# EasyEDA Pro project Sound Recorder IoT updated.epro

# Schematic Schematic1
Board Name: Board1; Create Date: 2025-07-08; Page Name: P1; Project Name: Sound Recorder IoT; Schematic Name: Schematic1; Update Date: 2025-07-19; Company: Rajj Engineering; Drawn: UsmanRajj; Page Size: A4; Part Number: JLCPCB-002; Reviewed: @rajjengg; Version: V0.1
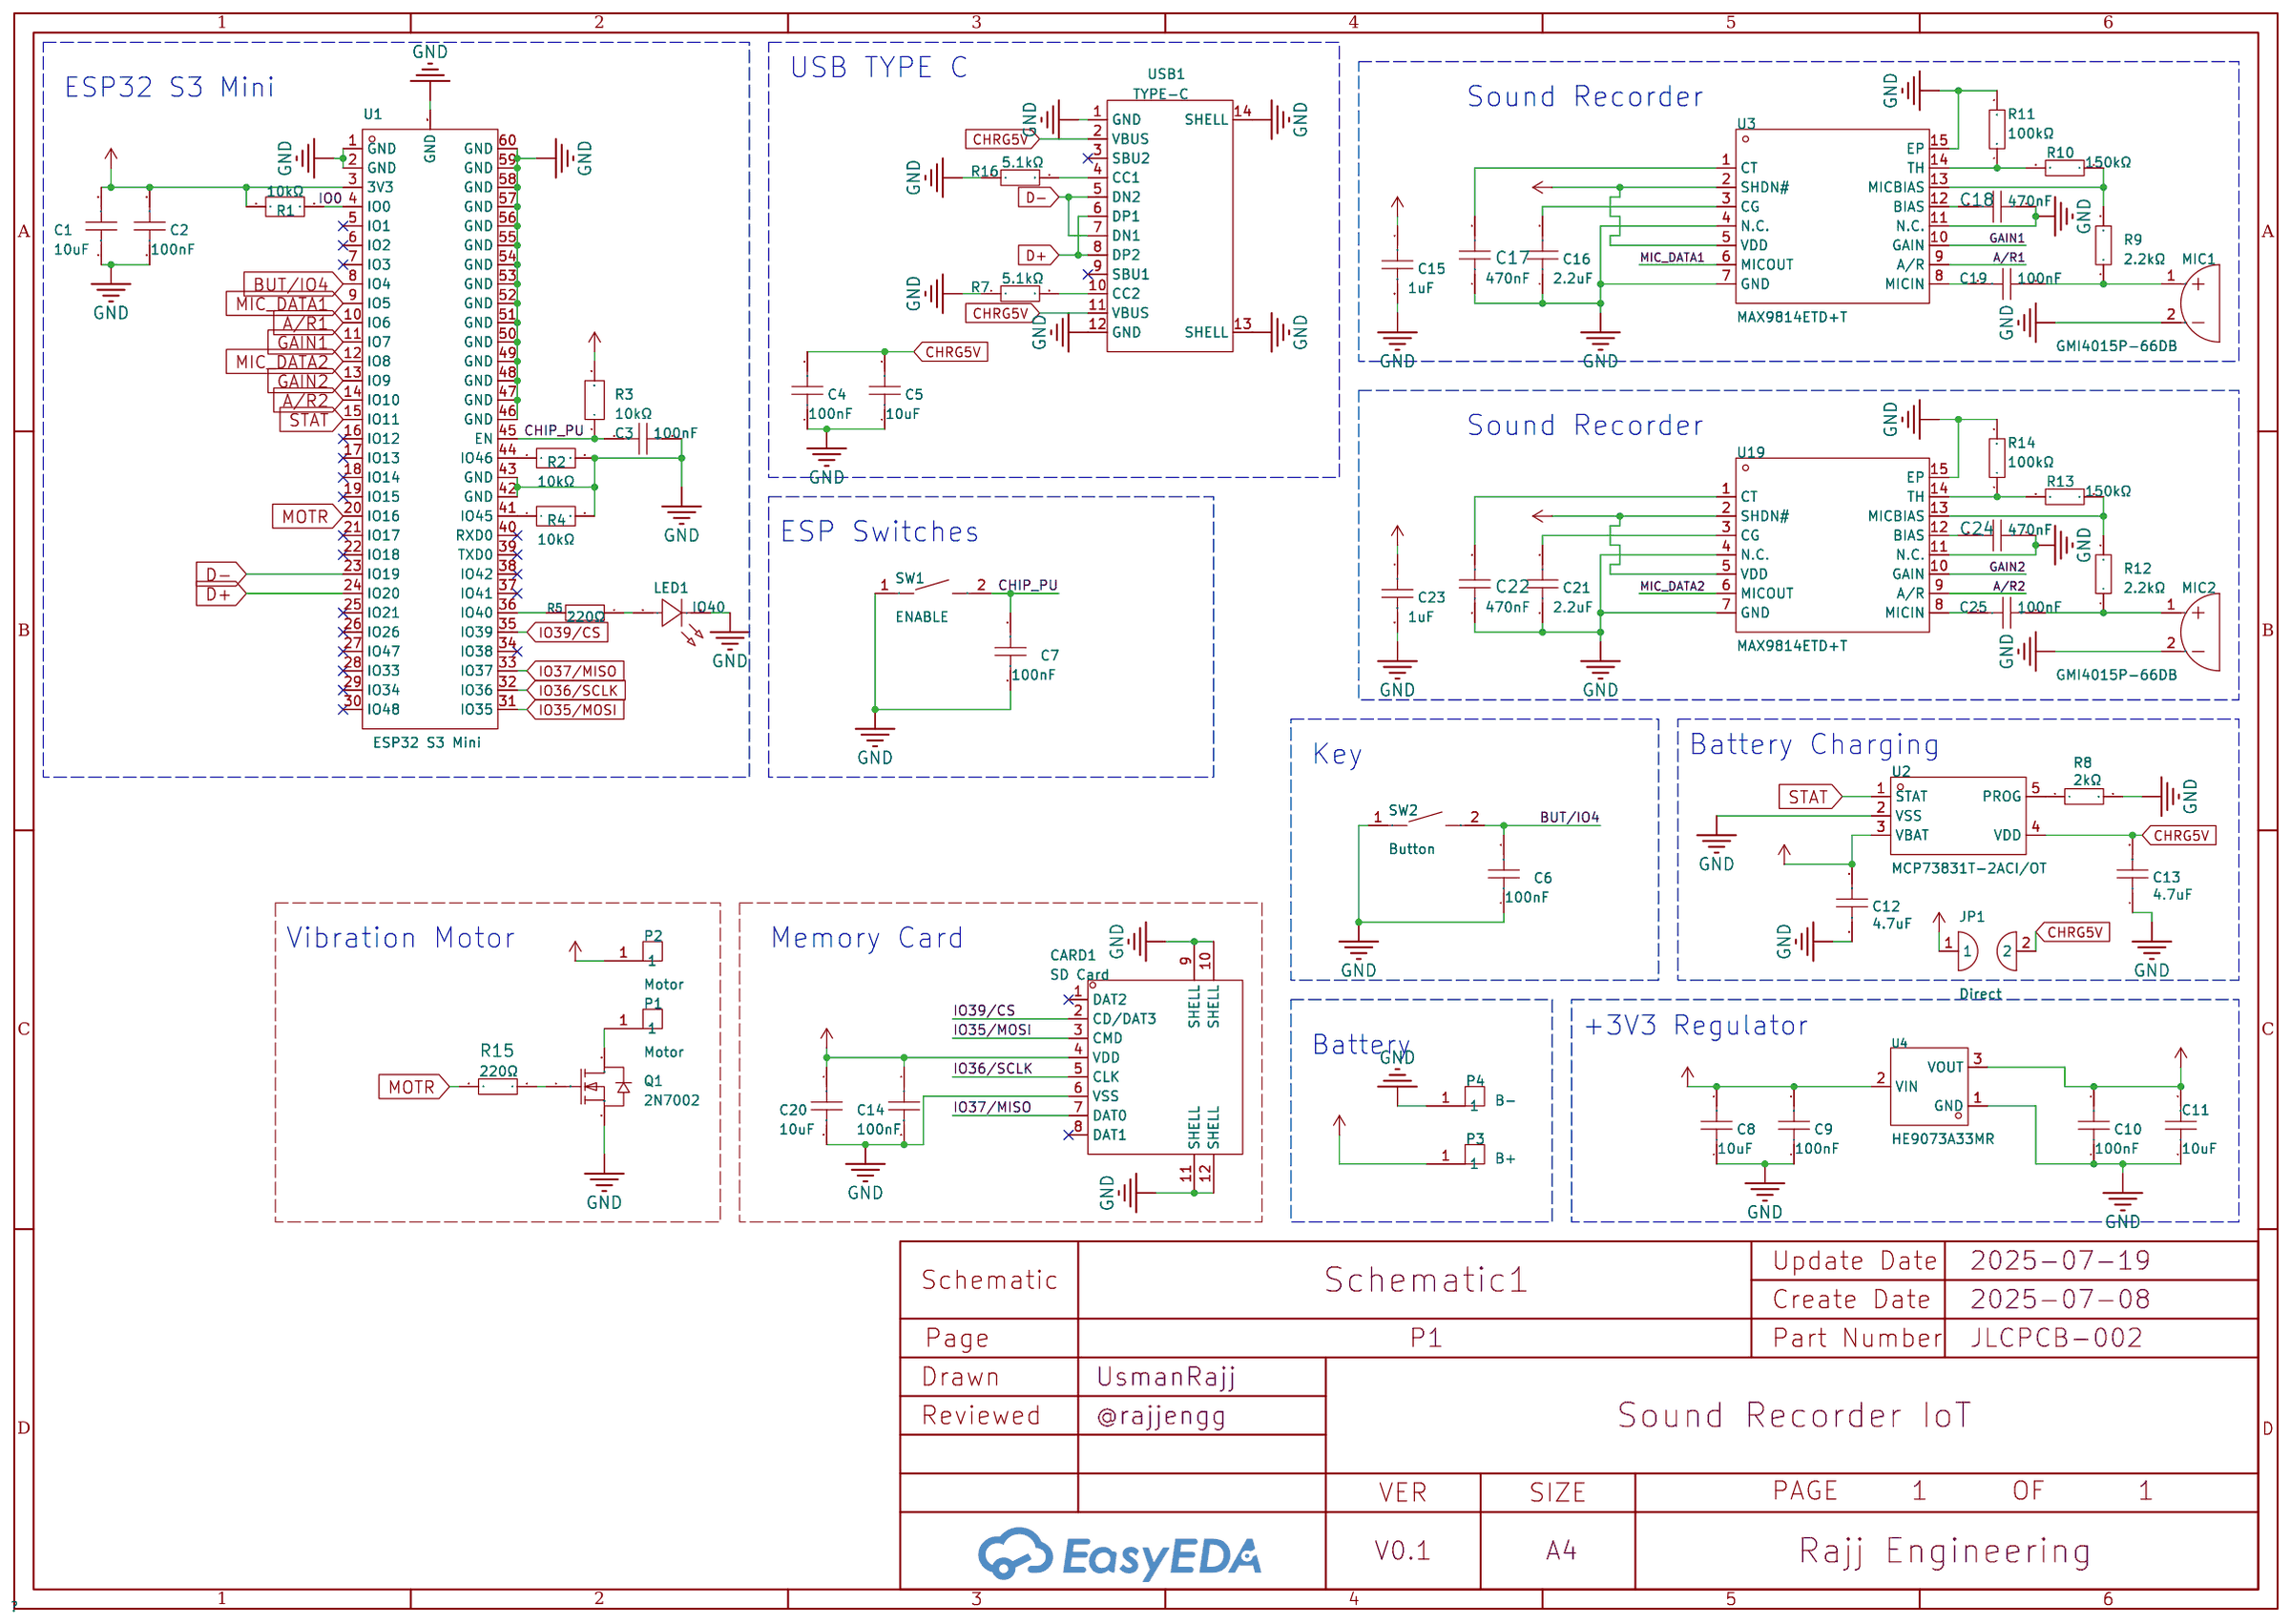
[diagram p0: schematic sheet]

## Parts
C1  10uF  [C0402]
C2  100nF  [C0201]
C3  100nF  [C0201]
C4  100nF  [C0201]
C5  10uF  [C0402]
C6  100nF  [C0201]
C7  100nF  [C0201]
C8  10uF  [C0402]
C9  100nF  [C0201]
C10  100nF  [C0201]
C11  10uF  [C0402]
C12  4.7uF  [C0402]
C13  4.7uF  [C0402]
C14  100nF  [C0201]
C15  1uF  [C0201]
C16  2.2uF  [C0201]
C17  470nF  [C0201]
C18  470nF  [C0201]
C19  100nF  [C0201]
C20  10uF  [C0402]
C21  2.2uF  [C0201]
C22  470nF  [C0201]
C23  1uF  [C0201]
C24  470nF  [C0201]
C25  100nF  [C0201]
CARD1  SD Card  [TF-SMD_TF-102-15]
JP1  Direct  [jumper pad]  (no BOM)
LED1  IO40  [LED0603-RD_BLUE]
MIC1  GMI4015P-66DB  [MIC-TH_BD4.0-P1.4-D0.4-L-FD]
MIC2  GMI4015P-66DB  [MIC-TH_BD4.0-P1.4-D0.4-L-FD]
P1  Motor  [SMD 1.5X2 PAD]  (no BOM)
P2  Motor  [SMD 1.5X2 PAD]  (no BOM)
P3  B+  [SMD 1.5X2 PAD]  (no BOM)
P4  B-  [SMD 1.5X2 PAD]  (no BOM)
Q1  2N7002  [SOT-23-3_L2.9-W1.3-P1.90-LS2.4-BR]
R1  10kΩ  [R0201]
R2  10kΩ  [R0201]
R3  10kΩ  [R0201]
R4  10kΩ  [R0201]
R5  220Ω  [R0402]
R7  5.1kΩ  [R0402]
R8  2kΩ  [R0402]
R9  2.2kΩ  [R0201]
R10  150kΩ  [R0201]
R11  100kΩ  [R0201]
R12  2.2kΩ  [R0201]
R13  150kΩ  [R0201]
R14  100kΩ  [R0201]
R15  220Ω  [R0402]
R16  5.1kΩ  [R0402]
SW1  ENABLE  [SW-SMD_L3.9-W3.0-P4.45]
SW2  Button  [SW-SMD_L3.9-W3.0-P4.45]
U1  ESP32 S3 Mini  [BULETM-SMD_ESP32-S3-MINI-1-N8]
U2  MCP73831T-2ACI/OT  [SOT-23-5_L3.0-W1.7-P0.95-LS2.8-BL]
U3  MAX9814ETD+T  [TDFN-14_L3.0-W3.0-P0.40-BL-EP]
U4  HE9073A33MR  [SOT-23-3_L2.9-W1.6-P1.90-LS2.8-BR-CW]
U19  MAX9814ETD+T  [TDFN-14_L3.0-W3.0-P0.40-BL-EP]
USB1  TYPE-C  [USB-C-SMD_TYPE-C-6PIN-2MD-073]

## Library data of the parts
C1 C5 C8 C11 C20 = CL05A106MP5NUNC_C315248: Capacitance: Tolerance:±20% Tolerance:±20% Voltage Rated: Temperature Coefficient:; LCSC Part Name: 10uF ±20% 10V; Supplier Part: C315248; Manufacturer: SAMSUNG(三星); Manufacturer Part: CL05A106MP5NUNC; Supplier Footprint: 0402; JLCPCB Part Class: Extended Part; Datasheet: https://atta.szlcsc.com/upload/public/pdf/source/20231220/1EF805BAE1520675928CC4638D279E74.pdf; Supplier: LCSC; Tolerance: ±20%
C2-C4 C6 C7 C9 C10 C14 C19 C25 = 0201X104K100NT: Capacitance:100nF Tolerance:±10% Tolerance:±10% Voltage Rating:10V Temperature Coefficient:X5R; LCSC Part Name: 100nF ±10% 10V; Supplier Part: C284966; Manufacturer: FH(风华); Supplier Footprint: 0201; JLCPCB Part Class: Extended Part; Datasheet: https://atta.szlcsc.com/upload/public/pdf/source/20200305/C486355_26A10D38EF8C2A5C37091D0039909270.pdf; Supplier: LCSC; Tolerance: ±10%; Voltage Rating: 10V; Temperature Coefficient: X5R
C12 C13 = 4.7uF: Supplier: LCSC; Supplier Part: C368809; Manufacturer: SAMSUNG(三星); Manufacturer Part: CL05A475KP5NRNC; JLCPCB Part Class: Extended Part
C15 C23 = CL03A105MP3NSNC: Capacitance: Tolerance:±20% Tolerance:±20% Voltage Rated: Temperature Coefficient:; LCSC Part Name: 1uF ±20% 10V; Supplier Part: C170153; Manufacturer: SAMSUNG(三星); Supplier Footprint: 0201; JLCPCB Part Class: Extended Part; Datasheet: https://atta.szlcsc.com/upload/public/pdf/source/20160218/1457707763339.pdf; Supplier: LCSC; Tolerance: ±20%
C16 C21 = 0201X225M6R3NT: Capacitance:2.2uF Tolerance:±20% Tolerance:±20% Voltage Rating:6.3V Temperature Coefficient:X5R; LCSC Part Name: 2.2uF ±20% 6.3V; Supplier Part: C285111; Manufacturer: FH(风华); Supplier Footprint: 0201; JLCPCB Part Class: Extended Part; Datasheet: https://atta.szlcsc.com/upload/public/pdf/source/20200305/C486355_26A10D38EF8C2A5C37091D0039909270.pdf; Supplier: LCSC; Tolerance: ±20%; Voltage Rating: 6.3V; Temperature Coefficient: X5R
C17 C18 C22 C24 = GRM033R60J474KE90D: Capacitance: Tolerance:±10% Tolerance:±10% Voltage Rated: Temperature Coefficient:; LCSC Part Name: 470nF ±10% 6.3V; Supplier Part: C85926; Manufacturer: muRata(村田); Supplier Footprint: 0201; JLCPCB Part Class: Extended Part; Datasheet: https://atta.szlcsc.com/upload/public/pdf/source/20221205/36AD9E487D387144DCAA275601317C9B.pdf; Supplier: LCSC; Tolerance: ±10%
CARD1 = TF-102-15: Card Connection Mode:Flip type Card Type:MicroSD card (TF card) Connector Type:Card Slot Additional Card Detection Pins:- Supplementary Features:- Maximum Body Height:1.6mm Operating Temperature Range:-25℃~+85℃ Operating Temperature Range:-25℃~+85℃; LCSC Part Name: 翻盖式 MicroSD卡(TF卡) 卡座; Supplier Part: C266609; Manufacturer: XUNPU(讯普); Supplier Footprint: SMD; JLCPCB Part Class: Extended Part; Datasheet: https://atta.szlcsc.com/upload/public/pdf/source/20210906/0DFE5F37C5A4FEB0620878352EFBDEA1.pdf; Supplier: LCSC; Card Connection Mode: Flip type; Card Type: MicroSD card (TF card); Connector Type: Card Slot; Maximum Body Height: 1.6mm; Operating Temperature Range: -25℃~+85℃
JP1 = Jumper Pad
LED1 = XL-1608UBC-04: Lamp Holder Type:- Illumination Color:Blue Voltage - Forward(Vf):3.3V Voltage - Forward(Vf):3.3V Power(Watts):70mW Forward Current:20mA Wavelength - Dominant:455nm~475nm Wavelength - Dominant:455nm~475nm Peak Wavelength:470nm Diode Configuration:- Lens Co; Supplier Part: C965807; Manufacturer: XINGLIGHT(成兴光); Supplier Footprint: 0603; JLCPCB Part Class: Extended Part; Datasheet: https://atta.szlcsc.com/upload/public/pdf/source/20250213/9D28F40E58C3285D8CA3C7212E2FBA3B.pdf; Supplier: LCSC; Illumination Color: Blue; Voltage - Forward(Vf): 3.3V; Power(Watts): 70mW; Forward Current: 20mA; Wavelength - Dominant: 455nm~475nm; Peak Wavelength: 470nm; Lens Color: Colorless Transparent Lens; Luminous Intensity: 300mcd; Viewing Angle: 120°; Mounting Sytle: Positive Stick; Operating Temperature: -20℃~+85℃
MIC1 MIC2 = GMI4015P-66DB: Supplier Part: C529912; Manufacturer: INGHAi(赢海); JLCPCB Part Class: Extended Part; Datasheet: https://atta.szlcsc.com/upload/public/pdf/source/20220523/E8FAB3C2390E3D02A259F1064655C50D.pdf; Supplier: LCSC
P1-P4 = SMD 1.5X2 PAD
Q1 = 2N7002_C8545: Type:1 N-Channel Drain Source Voltage (Vdss): Continuous Drain Current (Id): Drain Source On Resistance (RDS(on)@Vgs,Id):5Ω@10V Power Dissipation (Pd):225mW Gate Threshold Voltage (Vgs(th)@Id):2.5V@250uA Input Capacitance (Ciss@Vds):50pF Reverse Transfer; LCSC Part Name: 1个N沟道 耐压:60V 电流:115mA; Supplier Part: C8545; Manufacturer: CJ(江苏长电/长晶); Supplier Footprint: SOT-23; JLCPCB Part Class: Basic Part; Datasheet: https://atta.szlcsc.com/upload/public/pdf/source/20171228/C164913_15144413269051213916.pdf; Supplier: LCSC; Type: 1 N-Channel; Drain Source On Resistance (RDS(on)@Vgs,Id): 5Ω@10V; Power Dissipation (Pd): 225mW; Gate Threshold Voltage (Vgs(th)@Id): 2.5V@250uA; Input Capacitance (Ciss@Vds): 50pF; Reverse Transfer Capacitance (Crss@Vds): 5pF; Operating Temperature: -55℃~+150℃
R1-R4 = 0201WMF1002TEE: Type:Thick Film Resistors Resistance:10kΩ Tolerance:±1% Tolerance:±1% Power(Watts): Overload Voltage (Max): Temperature Coefficient:±200ppm/℃ Temperature Coefficient:±200ppm/℃ Operating Temperature Range:-55℃~+155℃ Operating Temperature Range:-55℃~+155℃; LCSC Part Name: 10kΩ ±1% 50mW 厚膜电阻; Supplier Part: C473048; Manufacturer: UNI-ROYAL(厚声); Supplier Footprint: 0201; JLCPCB Part Class: Extended Part; Datasheet: https://atta.szlcsc.com/upload/public/pdf/source/20200306/C422600_1E6D84923E4A46A82E41ADD87F860B5C.pdf; Supplier: LCSC; Type: Thick Film Resistors; Tolerance: ±1%; Temperature Coefficient: ±200ppm/℃; Operating Temperature Range: -55℃~+155℃
R5 R15 = 0402WGF2200TCE: Type:Thick Film Resistors Resistance: Tolerance:±1% Tolerance:±1% Power(Watts): Overload Voltage (Max): Temperature Coefficient:±100ppm/℃ Temperature Coefficient:±100ppm/℃ Operating Temperature Range:-55℃~+155℃ Operating Temperature Range:-55℃~+155℃; LCSC Part Name: 220Ω ±1% 62.5mW 厚膜电阻; Supplier Part: C25091; Manufacturer: UNI-ROYAL(厚声); Supplier Footprint: 0402; JLCPCB Part Class: Basic Part; Datasheet: https://atta.szlcsc.com/upload/public/pdf/source/20200306/C422600_1E6D84923E4A46A82E41ADD87F860B5C.pdf; Supplier: LCSC; Type: Thick Film Resistors; Tolerance: ±1%; Temperature Coefficient: ±100ppm/℃; Operating Temperature Range: -55℃~+155℃
R7 R16 = 5.1kΩ: Supplier: LCSC; Manufacturer: UNI-ROYAL(厚声); Manufacturer Part: 0402WGF5101TCE; Supplier Part: C25905; JLCPCB Part Class: Basic Part
R8 = 2kΩ: Supplier: LCSC; Manufacturer Part: 0402WGF2001TCE; Manufacturer: UNI-ROYAL(厚声); Supplier Part: C4109; JLCPCB Part Class: Basic Part
R9 R12 = RC0201FR-072K2L: Type:Thick Film Resistors Resistance: Tolerance:±1% Tolerance:±1% Power(Watts): Overload Voltage (Max): Temperature Coefficient:±200ppm/℃ Temperature Coefficient:±200ppm/℃ Operating Temperature Range:-55℃~+125℃ Operating Temperature Range:-55℃~+125℃; LCSC Part Name: 厚膜电阻 2.2kΩ ±1% 50mW; Supplier Part: C142018; Manufacturer: YAGEO(国巨); Supplier Footprint: 0201; JLCPCB Part Class: Extended Part; Datasheet: https://atta.szlcsc.com/upload/public/pdf/source/20180821/C275644_0D56F95EFF785E7D9A1FEF436B37DA78.pdf; Supplier: LCSC; Type: Thick Film Resistors; Tolerance: ±1%; Temperature Coefficient: ±200ppm/℃; Operating Temperature Range: -55℃~+125℃
R10 R13 = RC0201FR-07150KL: Type:Thick Film Resistors Resistance: Tolerance:±1% Tolerance:±1% Power(Watts): Overload Voltage (Max): Temperature Coefficient:±200ppm/℃ Temperature Coefficient:±200ppm/℃ Operating Temperature Range:-55℃~+125℃ Operating Temperature Range:-55℃~+125℃; LCSC Part Name: 厚膜电阻 150kΩ ±1% 50mW; Supplier Part: C274346; Manufacturer: YAGEO(国巨); Supplier Footprint: 0201; JLCPCB Part Class: Extended Part; Datasheet: https://atta.szlcsc.com/upload/public/pdf/source/20180821/C275644_0D56F95EFF785E7D9A1FEF436B37DA78.pdf; Supplier: LCSC; Type: Thick Film Resistors; Tolerance: ±1%; Temperature Coefficient: ±200ppm/℃; Operating Temperature Range: -55℃~+125℃
R11 R14 = RC0201FR-07100KL: Type:Thick Film Resistors Resistance: Tolerance:±1% Tolerance:±1% Power(Watts): Overload Voltage (Max): Temperature Coefficient:±200ppm/℃ Temperature Coefficient:±200ppm/℃ Operating Temperature Range:-55℃~+125℃ Operating Temperature Range:-55℃~+125℃; LCSC Part Name: 厚膜电阻 100kΩ ±1% 50mW; Supplier Part: C106224; Manufacturer: YAGEO(国巨); Supplier Footprint: 0201; JLCPCB Part Class: Extended Part; Datasheet: https://atta.szlcsc.com/upload/public/pdf/source/20181009/C309620_DA5935B6E1D48212CB7A533FE518B3C2.pdf; Supplier: LCSC; Type: Thick Film Resistors; Tolerance: ±1%; Temperature Coefficient: ±200ppm/℃; Operating Temperature Range: -55℃~+125℃
SW1 SW2 = TS-1088-AR02016: Circuit:SPST Actuator Style:Round Button Operating Force:160gf Mounting Style:Brick nogging Switch Length:4mm Switch Width:3mm Switch Height:2mm Strike Gundam:不带 Contact Current:50mA Voltage Rating (DC):12V Insulation Resistance:100MΩ Actuator/Cap Color:B; LCSC Part Name: 4*3*2mm 立贴 轻触开关; Supplier Part: C720477; Manufacturer: XUNPU(讯普); Supplier Footprint: SMD; JLCPCB Part Class: Basic Part; Datasheet: https://atta.szlcsc.com/upload/public/pdf/source/20200810/C720475_60D09DD6C54279ADDB2DC25100F1CC11.pdf; Supplier: LCSC; Circuit: SPST; Actuator Style: Round Button; Operating Force: 160gf; Mounting Style: Brick nogging; Switch Length: 4mm; Switch Width: 3mm; Switch Height: 2mm; Strike Gundam: 不带; Contact Current: 50mA; Voltage Rating (DC): 12V; Insulation Resistance: 100MΩ; Actuator/Cap Color: Black; Pin Style: SMDSplicing; Mechanical Life: 10万次; Operating Temperature: -30℃~+80℃
U1 = ESP32-S3-MINI-1-N8: Core Processor:ESP32-S3FN8 Chip Wireless Standard:- Support Interface:I2C；GPIO；SPI；PWM；ADC；UART；USB；I2S Frequency:2.4GHz Antenna Type:- Output Power:20.5dBm Output Power:20.5dBm Operating Voltage:- Operating Voltage:- Receive  Current:- Send  Current:- Se; Supplier Part: C2913206; Manufacturer: ESPRESSIF(乐鑫); Supplier Footprint: SMD; JLCPCB Part Class: Extended Part; Datasheet: https://atta.szlcsc.com/upload/public/pdf/source/20220425/7F117D7A09F85946280540FD9EFDF9F3.pdf; Supplier: LCSC; Core Processor: ESP32-S3FN8 Chip; Support Interface: I2C；GPIO；SPI；PWM；ADC；UART；USB；I2S; Output Power: 20.5dBm
U2 = MCP73831T-2ACI/OT: Supply Voltage:6V Supply Voltage:6V Maximum Charge Current:500mA Type of Battery:Lithium-ion/Polymer Number of Cells:1 Number of Cells:1 Operating Temperature:-40℃~+85℃ Operating Temperature:-40℃~+85℃; Supplier Part: C424093; Manufacturer: MICROCHIP(美国微芯); Supplier Footprint: SOT-23-5; JLCPCB Part Class: Extended Part; Datasheet: https://atta.szlcsc.com/upload/public/pdf/source/20190902/C424093_BB3CBFD6F009A8554318004A07DA97EE.pdf; Supplier: LCSC; Supply Voltage: 6V; Maximum Charge Current: 500mA; Type of Battery: Lithium-ion/Polymer; Number of Cells: 1; Operating Temperature: -40℃~+85℃
U3 U19 = MAX9814ETD+T: Class:AB Class Amplifier Speaker Channels:Monaural Output Power:- Voltage - Supply:2.7V~5.5V Voltage - Supply:2.7V~5.5V Operating Temperature:-40℃~+85℃ Operating Temperature:-40℃~+85℃; LCSC Part Name: 带自动增益控制和低噪声麦克风偏置的麦克风放大器; Supplier Part: C41714; Manufacturer: ADI(亚德诺)/MAXIM(美信); Supplier Footprint: TDFN-14-EP(3x3); JLCPCB Part Class: Extended Part; Datasheet: https://atta.szlcsc.com/upload/public/pdf/source/20150124/1457707262509.pdf; Supplier: LCSC; Class: AB Class Amplifier; Speaker Channels: Monaural; Voltage - Supply: 2.7V~5.5V; Operating Temperature: -40℃~+85℃
U4 = HE9073A33MR: Output Type: Maximum Input Voltage:7V Output Voltage:3.3V Output Voltage:3.3V MAX Output Current:500mA Power Supply Rejection Ratio (PSRR):70dB@1kHz Dropout Voltage:100mV standby current:300nA Output Polarity:Positive electrode Number of Outputs:1; LCSC Part Name: 输入7V 输出3.3V 500mA; Supplier Part: C723793; Manufacturer: HEERMICR(赫尔半导体); Supplier Footprint: SOT-23; JLCPCB Part Class: Extended Part; Datasheet: https://atta.szlcsc.com/upload/public/pdf/source/20220117/47EB847C6E7A90A5210F7BB8E361894A.pdf; Supplier: LCSC; Maximum Input Voltage: 7V; Output Voltage: 3.3V; MAX Output Current: 500mA; Power Supply Rejection Ratio (PSRR): 70dB@1kHz; Dropout Voltage: 100mV; standby current: 300nA; Output Polarity: Positive electrode; Number of Outputs: 1
USB1 = TYPE-C: Supplier: LCSC; Supplier Part: C2765186; Manufacturer: SHOU HAN(首韩); Manufacturer Part: TYPE-C 16PIN 2MD(073); JLCPCB Part Class: Extended Part

## Nets
GND: C1.1 C2.1 C3.1 C4.1 C5.1 C6.1 C7.1 C8.1 C9.1 C10.1 C11.1 C12.1 C13.1 C14.2 C15.2 C16.1 C17.1 C18.1 C20.2 C21.1 C22.1 C23.2 C24.1 CARD1.6(VSS) CARD1.9(SHELL) CARD1.10(SHELL) CARD1.11(SHELL) CARD1.12(SHELL) LED1.1(K) MIC1.2 MIC2.2 P4.1 Q1.2(S) R2.2 R4.2 R7.1 R8.2 R11.2 R14.2 R16.1 SW1.1 SW2.1 U1.1(GND) U1.2(GND) U1.42(GND) U1.43(GND) U1.46(GND) U1.47(GND) U1.48(GND) U1.49(GND) U1.50(GND) U1.51(GND) U1.52(GND) U1.53(GND) U1.54(GND) U1.55(GND) U1.56(GND) U1.57(GND) U1.58(GND) U1.59(GND) U1.60(GND) U1.GND U2.2(VSS) U3.4(N.C.) U3.7(GND) U3.11(N.C.) U3.15(EP) U4.1(GND) U19.4(N.C.) U19.7(GND) U19.11(N.C.) U19.15(EP) USB1.1(GND) USB1.12(GND) USB1.13(SHELL) USB1.14(SHELL)
A/R1: U1.10(IO6) U3.9(A/R)
A/R2: U1.14(IO10) U19.9(A/R)
BUT/IO4: C6.2 SW2.2 U1.8(IO4)
CHIP_PU: C3.2 C7.2 R3.1 SW1.2 U1.45(EN)
CHRG5V: C4.2 C5.2 C13.2 JP1.2 U2.4(VDD) USB1.2(VBUS) USB1.11(VBUS)
D+: U1.24(IO20) USB1.6(DP1) USB1.8(DP2)
D-: U1.23(IO19) USB1.5(DN2) USB1.7(DN1)
GAIN1: U1.11(IO7) U3.10(GAIN)
GAIN2: U1.13(IO9) U19.10(GAIN)
IO0: R1.2 U1.4(IO0)
IO35/MOSI: CARD1.3(CMD) U1.31(IO35)
IO36/SCLK: CARD1.5(CLK) U1.32(IO36)
IO37/MISO: CARD1.7(DAT0) U1.33(IO37)
IO39/CS: CARD1.2(CD/DAT3) U1.35(IO39)
MIC_DATA1: U1.9(IO5) U3.6(MICOUT)
MIC_DATA2: U1.12(IO8) U19.6(MICOUT)
MOTR: R15.2 U1.20(IO16)
POWER_+3V3: C1.2 C2.2 C10.2 C11.2 C14.1 C15.1 C20.1 C23.1 CARD1.4(VDD) R1.1 R3.2 U1.3(3V3) U3.2(SHDN#) U3.5(VDD) U4.3(VOUT) U19.2(SHDN#) U19.5(VDD)
POWER_VDC: C8.2 C9.2 C12.2 JP1.1 P2.1 P3.1 U2.3(VBAT) U4.2(VIN)
STAT: U1.15(IO11) U2.1(STAT)
$1N1776: LED1.2(A) R5.1
$1N1782: R5.2 U1.36(IO40)
$1N2565: R8.1 U2.5(PROG)
$1N4192: C16.2 U3.3(CG)
$1N4769: C17.2 U3.1(CT)
$1N4937: C18.2 U3.12(BIAS)
$1N4974: C19.2 U3.8(MICIN)
$1N5042: C19.1 MIC1.1 R9.1
$1N5142: R9.2 R10.1 U3.13(MICBIAS)
$1N5258: R10.2 R11.1 U3.14(TH)
$1N5975: C21.2 U19.3(CG)
$1N5978: C22.2 U19.1(CT)
$1N5981: C24.2 U19.12(BIAS)
$1N5983: C25.2 U19.8(MICIN)
$1N5985: C25.1 MIC2.1 R12.1
$1N5990: R12.2 R13.1 U19.13(MICBIAS)
$1N5994: R13.2 R14.1 U19.14(TH)
$1N6124: R2.1 U1.44(IO46)
$1N6163: R4.1 U1.41(IO45)
$1N6361: Q1.1(G) R15.1
$1N6452: P1.1 Q1.3(D)
$1N16448: R16.2 USB1.4(CC1)
$1N16453: R7.2 USB1.10(CC2)

Not connected (* = marked no-connect by the designer): CARD1 1(DAT2)* 8(DAT1)*; U1 5(IO1)* 6(IO2)* 7(IO3)* 16(IO12)* 17(IO13)* 18(IO14)* 19(IO15)* 21(IO17)* 22(IO18)* 25(IO21)* 26(IO26)* 27(IO47)* 28(IO33)* 29(IO34)* 30(IO48)* 34(IO38)* 37(IO41)* 38(IO42)* 39(TXD0)* 40(RXD0)*; USB1 3(SBU2)* 9(SBU1)*

## Notes on the sheet
- USB TYPE C
- ESP32 S3 Mini
- Sound Recorder
- Sound Recorder
- ESP Switches
- Key
- Battery Charging
- Vibration Motor
- Memory Card
- +3V3 Regulator
- Battery

# Board PCB1
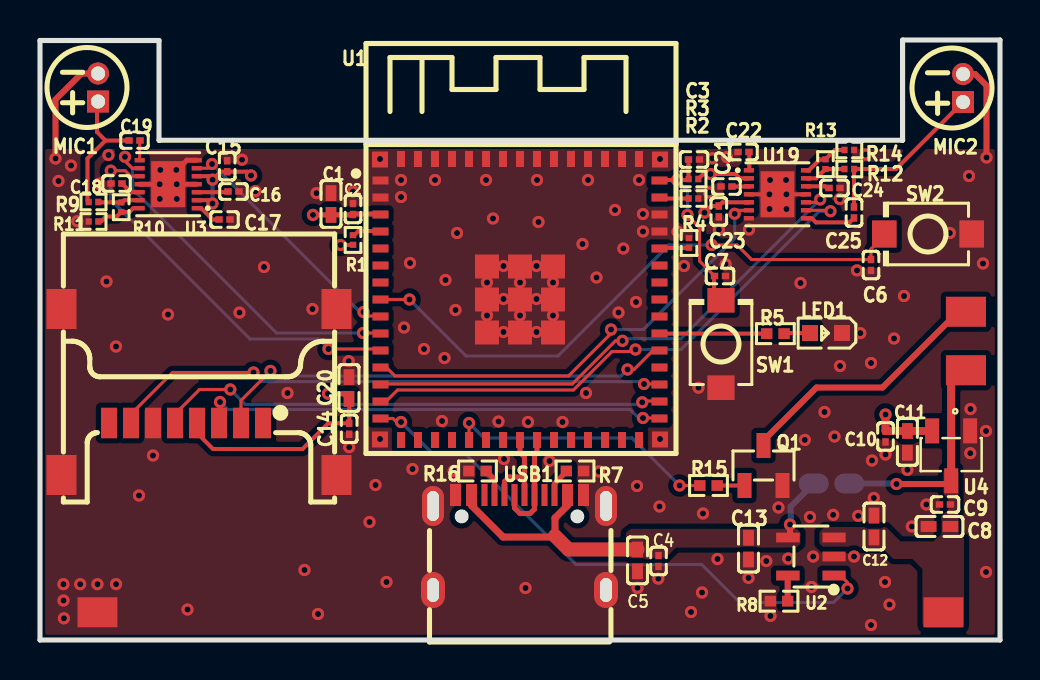
[diagram p1: board, top side]
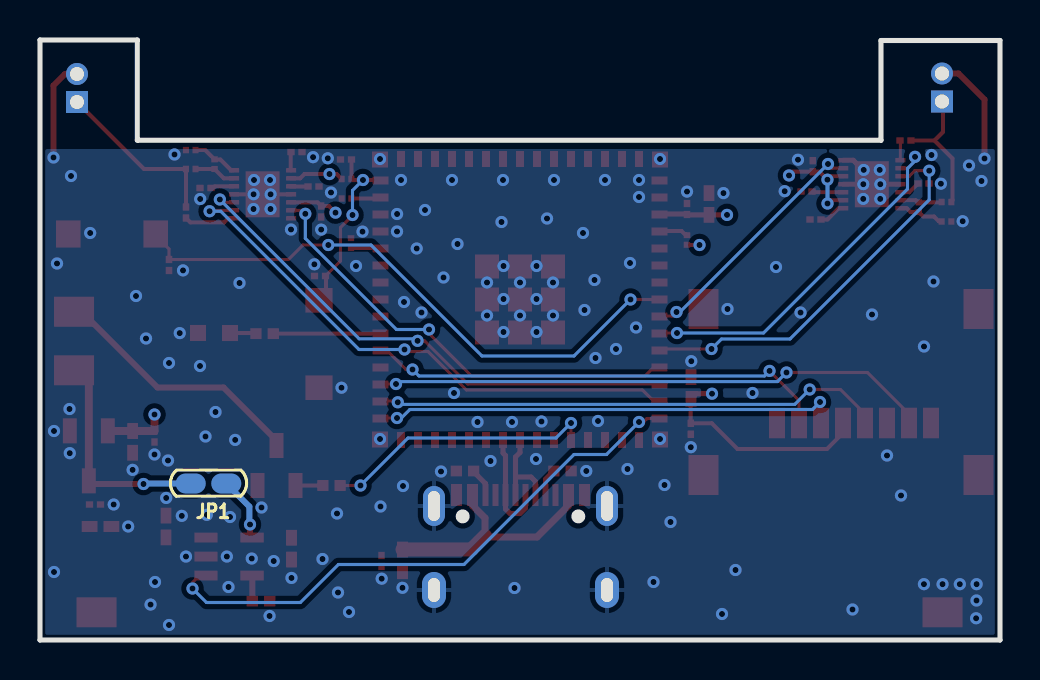
[diagram p2: board, bottom side, seen from below]

Outline 48 x 30 mm; copper layers: Top Layer, Inner1, Inner2, Bottom Layer. Coordinates in mm from the lower left corner of the outline.
Outline path: 0,29.97 0,0 48,0 48,30 43.13,30 43.13,24.99 5.95,24.99 5.95,29.97 0,29.97
Stack: Top Layer 0.035mm Outer layer thickness 1oz / Dielectric1 0.2104mm 7628 RC49% 8.6mil / Inner1 0.0152mm Inner layer thickness / Dielectric2 1.065mm 1.1mm H/HOZ Copper / Inner2 0.0152mm Inner layer thickness / Dielectric3 0.2104mm 7628 RC49% 8.6mil / Bottom Layer 0.035mm Outer layer thickness 1oz

## Design rules (mm)
template: Custom Config
spacing copperThickness1oz (default): track to track 0.102, other pairs 0.152 to 0.3
spacing copperThickness2oz: track to track 0.203, other pairs 0.152 to 0.3
track width copperThickness1oz (default): min 0.127, default 0.254, max 2.54
track width copperThickness2oz: min 0.203, default 0.254, max 2.54
differential pair differentialPair (default): width min 0.127, default 0.254, max 2.54; gap min 0.152, default 0.152
via viaSize (default): diameter min 0.5, default 0.61, max 10; hole min 0.3, default 0.305, max 6.3
pour e241 uses copperRegion1
pour e595 uses copperRegion1
pour e197 uses copperRegion1

## Placement (name value [footprint] x y rotation side)
C1  10uF  [C0402]  14.55 21.8 270 top
C2  100nF  [C0201]  15.65 21.55 270 top
C3  100nF  [C0201]  32.7 24.03 180 top
C4  100nF  [C0201]  30.93 3.95 90 top
C5  10uF  [C0402]  29.88 3.98 90 top
C6  100nF  [C0201]  41.55 18.75 90 top
C7  100nF  [C0201]  34 18.2 180 top
C8  10uF  [C0402]  44.97 5.67 0 top
C9  100nF  [C0201]  45.25 6.78 0 top
C10  100nF  [C0201]  42.28 10.17 90 top
C11  10uF  [C0402]  43.37 9.91 90 top
C12  4.7uF  [C0402]  41.7 5.67 270 top
C13  4.7uF  [C0402]  35.43 4.57 90 top
C14  100nF  [C0201]  15.46 10.56 270 top
C15  1uF  [C0201]  9.36 23.69 90 top
C16  2.2uF  [C0201]  9.68 22.42 180 top
C17  470nF  [C0201]  9.22 21.03 180 top
C18  470nF  [C0201]  3.82 22.83 0 top
C19  100nF  [C0201]  4.72 24.97 0 top
C20  10uF  [C0402]  15.45 12.6 90 top
C21  2.2uF  [C0201]  34.32 22.67 0 top
C22  470nF  [C0201]  35.18 24.4 0 top
C23  1uF  [C0201]  33.94 21.43 270 top
C24  470nF  [C0201]  39.72 22.6 180 top
C25  100nF  [C0201]  40.7 21.38 270 top
CARD1  SD Card  [TF-SMD_TF-102-15]  7.95 12.4 0 top
JP1  Direct  [jumper pad]  39.57 7.83 180 bottom
LED1  IO40  [LED0603-RD_BLUE]  39.3 15.35 180 top
MIC1  GMI4015P-66DB  [MIC-TH_BD4.0-P1.4-D0.4-L-FD]  2.9 27.62 90 top
MIC2  GMI4015P-66DB  [MIC-TH_BD4.0-P1.4-D0.4-L-FD]  46.15 27.6 90 top
P1  Motor  [SMD 1.5X2 PAD]  46.3 16.41 0 top
P2  Motor  [SMD 1.5X2 PAD]  46.3 13.49 180 top
P3  B+  [SMD 1.5X2 PAD]  45.17 1.39 0 top
P4  B-  [SMD 1.5X2 PAD]  2.87 1.39 0 top
Q1  2N7002  [SOT-23-3_L2.9-W1.3-P1.90-LS2.4-BR]  36.18 8.72 270 top
R1  10kΩ  [R0201]  15.65 20 90 top
R2  10kΩ  [R0201]  32.68 22.08 0 top
R3  10kΩ  [R0201]  32.68 23.05 0 top
R4  10kΩ  [R0201]  32.45 19.85 90 top
R5  220Ω  [R0402]  36.77 15.32 180 top
R7  5.1kΩ  [R0402]  26.75 8.45 180 top
R8  2kΩ  [R0402]  36.95 1.94 180 top
R9  2.2kΩ  [R0201]  2.68 21.9 0 top
R10  150kΩ  [R0201]  4.06 21.64 270 top
R11  100kΩ  [R0201]  2.68 20.92 180 top
R12  2.2kΩ  [R0201]  40.47 23.55 180 top
R13  150kΩ  [R0201]  39.27 23.79 90 top
R14  100kΩ  [R0201]  40.47 24.5 0 top
R15  220Ω  [R0402]  33.43 7.72 180 top
R16  5.1kΩ  [R0402]  21.88 8.45 0 top
SW1  ENABLE  [SW-SMD_L3.9-W3.0-P4.45]  34.05 14.8 90 top
SW2  Button  [SW-SMD_L3.9-W3.0-P4.45]  44.4 20.3 180 top
U1  ESP32 S3 Mini  [BULETM-SMD_ESP32-S3-MINI-1-N8]  24 17.03 0 top
U2  MCP73831T-2ACI/OT  [SOT-23-5_L3.0-W1.7-P0.95-LS2.8-BL]  38.55 4.17 90 top
U3  MAX9814ETD+T  [TDFN-14_L3.0-W3.0-P0.40-BL-EP]  6.41 22.79 90 top
U4  HE9073A33MR  [SOT-23-3_L2.9-W1.6-P1.90-LS2.8-BR-CW]  45.56 9.21 90 top
U19  MAX9814ETD+T  [TDFN-14_L3.0-W3.0-P0.40-BL-EP]  36.87 22.28 270 top
USB1  TYPE-C  [USB-C-SMD_TYPE-C-6PIN-2MD-073]  23.97 4.88 0 top

## Footprints (pads in the part's own frame, mm; a bottom-side part is the same pattern mirrored in y, then rotated)
BULETM-SMD_ESP32-S3-MINI-1-N8
  rect 0.8x0.4 smd: 1(-6.975,5.95) 2(-6.975,5.1) 3(-6.975,4.25) 4(-6.975,3.4) 5(-6.975,2.55) 6(-6.975,1.7) 7(-6.975,0.85) 8(-6.975,0) 9(-6.975,-0.85) 10(-6.975,-1.7) 11(-6.975,-2.55) 12(-6.975,-3.4) 13(-6.975,-4.25) 14(-6.975,-5.1) 15(-6.975,-5.95) 31(6.975,-5.95) 32(6.975,-5.1) 33(6.975,-4.25) 34(6.975,-3.4) 35(6.975,-2.55) 36(6.975,-1.7) 37(6.975,-0.85) 38(6.975,0) 39(6.975,0.85) 40(6.975,1.7) 41(6.975,2.55) 42(6.975,3.4) 43(6.975,4.25) 44(6.975,5.1) 45(6.975,5.95)
  rect 0.4x0.8 smd: 16(-5.95,-7.025) 17(-5.1,-7.025) 18(-4.25,-7.025) 19(-3.4,-7.025) 20(-2.55,-7.025) 21(-1.7,-7.025) 22(-0.85,-7.025) 23(0,-7.025) 24(0.85,-7.025) 25(1.7,-7.025) 26(2.55,-7.025) 27(3.4,-7.025) 28(4.25,-7.025) 29(5.1,-7.025) 30(5.95,-7.025) 46(5.95,7.025) 47(5.1,7.025) 48(4.25,7.025) 49(3.4,7.025) 50(2.55,7.025) 51(1.7,7.025) 52(0.85,7.025) 53(0,7.025) 54(-0.85,7.025) 55(-1.7,7.025) 56(-2.55,7.025) 57(-3.4,7.025) 58(-4.25,7.025) 59(-5.1,7.025) 60(-5.95,7.025)
  rect 0.8x0.8 smd: GND(-7,7) GND(-7,-7) GND(7,7) GND(7,-7)
  rect 1.2x1.2 smd: GND(-1.65,1.65) GND(-1.65,0) GND(-1.65,-1.65) GND(0,1.65) GND(0,0) GND(0,-1.65) GND(1.65,1.65) GND(1.65,0) GND(1.65,-1.65)
C0201
  rect 0.368x0.324 smd: 1(-0.275,0) 2(0.275,0)
C0402
  rect 0.79x0.54 smd: 1(-0.545,0) 2(0.545,0)
jumper pad
  oval 1.5x1 smd: 1(-0.889,0) 2(0.889,0)
LED0603-RD_BLUE
  rect 0.8x0.8 smd: 1(-0.799,-0.004) 2(0.799,0.004)
MIC-TH_BD4.0-P1.4-D0.4-L-FD
  rect 1.1x1.1 hole 0.7: 1(-0.7,0)
  round 1.1 hole 0.7: 2(0.7,0)
R0201
  rect 0.303x0.324 smd: 1(-0.241,0) 2(0.241,0)
R0402
  rect 0.566x0.54 smd: 1(-0.433,0) 2(0.433,0)
SMD 1.5X2 PAD
  rect 2x1.5 smd: 1(0,0)
SOT-23-3_L2.9-W1.3-P1.90-LS2.4-BR
  rect 1.25x0.7 smd: 1(1,-0.95) 2(1,0.95) 3(-1,0)
SOT-23-3_L2.9-W1.6-P1.90-LS2.8-BR-CW
  rect 1.25x0.7 smd: 1(1.25,-0.95) 2(-1.25,0) 3(1.25,0.95)
SOT-23-5_L3.0-W1.7-P0.95-LS2.8-BL
  rect 0.49x1.157 smd: 1(-0.95,-1.153) 2(0,-1.153) 3(0.95,-1.153)
  rect 0.49x1.175 smd: 4(0.95,1.153) 5(-0.95,1.153)
SW-SMD_L3.9-W3.0-P4.45
  rect 1.23x1.36 smd: 1(-2.185,0) 2(2.185,0)
TDFN-14_L3.0-W3.0-P0.40-BL-EP
  rect 0.224x0.505 smd: 1(-1.2,-1.427) 2(-0.8,-1.427) 3(-0.4,-1.427) 4(0,-1.427) 5(0.4,-1.427) 6(0.8,-1.427) 7(1.2,-1.427) 8(1.2,1.427) 9(0.8,1.427) 10(0.4,1.427) 11(0,1.427) 12(-0.4,1.427) 13(-0.8,1.427) 14(-1.2,1.427)
  rect 2.3x1.7 smd: 15(0,0)
TF-SMD_TF-102-15
  rect 0.8x1.524 smd: 1(3.2,-1.55) 2(2.1,-1.55) 3(1,-1.55) 4(-0.1,-1.55) 5(-1.2,-1.55) 6(-2.3,-1.55) 7(-3.4,-1.55) 8(-4.5,-1.55)
  rect 1.5x2 smd: 9(-6.875,4.15) 10(-6.875,-4.15) 11(6.875,4.15) 12(6.875,-4.15)
USB-C-SMD_TYPE-C-6PIN-2MD-073
  rect 0.55x1.1 smd: 1(-3.2,2.375) 2(-2.4,2.375) 11(2.4,2.375) 12(3.2,2.375)
  rect 0.3x1.1 smd: 3(-1.75,2.375) 4(-1.25,2.375) 5(-0.75,2.375) 6(-0.25,2.375) 7(0.25,2.375) 8(0.75,2.375) 9(1.25,2.375) 10(1.75,2.375)
  oval 1.1x2 hole 0.6x1.5: 13(-4.325,1.825) 14(4.325,1.825)
  oval 1.2x1.8 hole 0.6x1.2: 13(-4.325,-2.375) 14(4.325,-2.375)

## Nets
As in the schematic.

Pads without a net: CARD1 1 8; U1 5 6 7 16 17 18 19 21 22 25 26 27 28 29 30 34 37 38 39 40; USB1 3 9

## Via types
v1: diameter 0.61, hole 0.305, Top Layer to Bottom Layer, 192 vias

## Routing (per net, layer and track width the routed paths; a pad name or vN(x,y) marks a point on that pad's centre or on a via; arc(x,y) is an arc through that point)
GND: length 15.9
  Top Layer w0.2: U19.11 v1(37.32,22.28) ; U19.4 v1(36.47,22.28)
  Top Layer w0.25: 4.98,22.79 v1(5.99,22.79) ; U3.7 7.34,23.99 6.85,23.5 v1(6.81,23.5) ; U3.4 v1(6.84,22.79)
  Top Layer w0.3: MIC2.2 46.75,28.3 47.32,27.72 v1(47.32,24.12) ; MIC1.2 2.07,28.33 0.78,27.03 v1(0.78,24.08)
  vias: v1(0.92,22.95) v1(1.17,2.79) v1(1.17,1.97) v1(1.19,1.09) v1(1.55,23.72) v1(1.87,20.94) v1(2.01,2.79) v1(2.87,2.79) v1(2.96,22.81) v1(3.32,17.92) v1(3.43,24.25) v1(3.8,14.67) v1(3.8,2.79) v1(4.95,7.22) v1(5.65,9.22) v1(6.01,23.5) v1(5.99,22.06) v1(6.4,16.28) v1(6.84,22.06) v1(7.38,1.53) v1(9.97,16.37) v1(10.1,24.01) v1(10.77,22.44) v1(11.2,18.65) v1(12.38,12.35) v1(13.22,3.5) v1(13.62,16.55) v1(13.83,22.34) v1(13.9,1.3) v1(15.44,13.94) v1(15.46,9.64) v1(15.65,22.42) v1(16.47,5.9) v1(16.78,7.75) v1(17,24.05) v1(17,10.05) v1(17.32,2.9) v1(18.05,23) v1(18.05,22.15) v1(18.2,15.62) v1(18.5,18.85) v1(18.62,8.55) v1(19.2,14.55) v1(19.75,23) v1(20.1,10.95) v1(20.22,14.1) v1(20.28,18) v1(20.69,8.45) v1(20.85,20.35) v1(20.78,16.5) v1(22.3,23) v1(22.35,17.88) v1(22.35,16.22) v1(22.65,21.08) v1(22.93,10.92) v1(23.18,18.7) v1(23.18,17.05) v1(23.18,15.4) v1(23.2,9.05) v1(24,17.88) v1(24,16.22) v1(24.28,2.6) v1(24.4,10.9) v1(24.85,23) v1(24.82,18.7) v1(24.82,17.05) v1(24.82,15.4) v1(24.93,20.9) v1(25.47,8.95) v1(25.65,17.88) v1(25.65,16.22) v1(26.12,10.9) v1(27.12,19.8) v1(27.3,12.35) v1(27.4,23) v1(27.82,18.12) v1(27.95,8.42) v1(28.75,21.5) v1(28.93,16.38) v1(29.17,19.58) v1(29.8,16.9) v1(29.85,7.7) v1(29.95,23) v1(29.88,2.61) v1(30.15,21.3) v1(30.15,20.42) v1(30.92,3.07) v1(31,24.05) v1(31,10.05) v1(30.97,6.67) v1(31.88,20.42) v1(32.2,18.7) v1(32.55,1.4) v1(32.93,12.61) v1(33.1,2.38) v1(33.15,6.33) v1(33.45,22.38) v1(33.61,24.09) v1(33.94,20.52) v1(33.88,4.05) v1(34.35,24.14) v1(34.28,18.78) v1(35.45,20.53) v1(35.43,3.1) v1(36.31,3.95) v1(36.5,23) v1(36.47,21.55) v1(36.52,1.2) v1(36.93,6.62) v1(37.3,23) v1(37.32,21.55) v1(37.41,4.07) v1(38.03,17.85) v1(38.24,10) v1(38.5,6.15) v1(38.57,2.65) v1(38.66,4.17) v1(39.22,11.4) v1(39.72,10.17) v1(39.66,6.26) v1(39.99,22.05) v1(40,13.7) v1(40.7,4.17) v1(40.85,18.48) v1(40.91,6.21) v1(41.01,15.34) v1(41.28,24.28) v1(41.55,13.85) v1(41.6,8.97) v1(41.55,0.75) v1(41.69,7.1) v1(42.25,2.9) v1(42.28,9.28) v1(42.47,1.77) v1(42.7,15.08) v1(43.2,17.2) v1(43.37,8.51) v1(43.59,5.67) v1(44.32,6.78) v1(45.49,20.35) v1(46.45,23.2) v1(46.53,11.55) v1(46.51,9.34) v1(47.15,18.83) v1(47.3,10.45) v1(47.3,3.4)
A/R1: length 18.2
  Top Layer w0.154: 4.98,23.59 4.61,23.59 4.25,23.95 v1(4.25,24.16) ; 17.03,15.35 v1(16.15,15.35)
  Bottom Layer w0.154: v1(16.15,15.35) 11.82,15.35 4.62,22.55 4.62,23.58 4.25,23.95 v1(4.25,24.16)
A/R2: length 27.7
  Top Layer w0.154: U19.9 39.47,21.48 v1(39.52,21.44) ; 17.03,11.95 17.32,11.95 17.88,12.5 26.68,12.5 28.6,14.42 29.68,14.42 v1(29.78,14.53)
  Bottom Layer w0.154: v1(29.78,14.53) 32.05,14.53 38.96,21.44 v1(39.52,21.44)
BUT/IO4: length 29.8
  Top Layer w0.154: v1(33.58,19.75) 34.85,19.75 35.58,19.02 C6.2 41.55,19.55 42.22,20.22 SW2.2 ; U1.8 v1(18.47,17.03)
  Bottom Layer w0.154: v1(18.47,17.03) 21.3,14.2 25.9,14.2 31.45,19.75 v1(33.58,19.75)
CHIP_PU: length 9.4
  Top Layer w0.154: C7.2 32.97,18.95 32.97,20.62 32.38,21.22 v1(32.38,21.25)
  Top Layer w0.2: SW1.2 34.03,16.98 33.7,17.31 33.7,18.17 C7.2 ; 30.97,23 v1(31.85,23) 32.38,23 R3.1 32.43,23.06 C3.2
  Bottom Layer w0.154: v1(32.38,21.25) 32.38,22.48 v1(31.85,23)
CHRG5V: length 15.3
  Top Layer w0.3: U2.4 37.5,5.23 v1(37.5,5.78)
  Top Layer w0.35: USB1.11 26.38,6.72 25.75,6.1 25.75,5.21 25.69,5.15 23.15,5.15 21.57,6.72 USB1.2
  Top Layer w0.7: 25.75,5.21 26.43,4.53 C5.2
  Bottom Layer w0.3: JP1.2 37.53,6.67 37.53,5.81 v1(37.5,5.78)
D+: length 5.4
  Top Layer w0.254: U1.24 24.85,9.35 24.72,9.22 USB1.8 24.72,6.55 24.5,6.33 24,6.33 23.72,6.6 USB1.6
D-: length 4.6
  Top Layer w0.254: 24.22,8.12 24.22,9.15 24,9.38 U1.23 ; 24.22,8.12 USB1.7 ; 24.22,8.12 24.2,8.15 23.45,8.15 23.22,7.92 USB1.5
GAIN1: length 19.6
  Top Layer w0.154: v1(3.54,23.47) 4.26,23.47 4.54,23.19 4.98,23.19 ; v1(14.43,14.55) 16.97,14.55 17.03,14.5
  Bottom Layer w0.154: v1(14.43,14.55) 13.93,15.05 10.5,15.05 3.54,22.01 v1(3.54,23.47)
GAIN2: length 26.5
  Top Layer w0.154: 38.32,21.88 38.87,21.88 v1(39.01,22.03) ; v1(29.12,14.96) 28.77,14.96 26.61,12.8 17.03,12.8
  Bottom Layer w0.154: v1(29.12,14.96) 29.22,15.06 32.04,15.06 v1(39.01,22.03)
IO0: length 1.5
  Top Layer w0.2: 17.03,20.45 15.93,20.45 15.72,20.24 R1.2
IO35/MOSI: length 23.4
  Top Layer w0.154: v1(9,11.9) 9,10.88 8.95,10.83 ; v1(30.15,11.1) 30.97,11.1
  Bottom Layer w0.154: v1(9,11.9) 9.38,11.53 29.51,11.53 29.93,11.1 v1(30.15,11.1)
IO36/SCLK: length 25.6
  Top Layer w0.154: v1(9.52,12.53) 7.97,12.53 6.75,11.3 6.75,10.83 ; 30.97,11.95 30.18,11.95 v1(30.11,11.89)
  Bottom Layer w0.154: v1(30.11,11.89) 30.01,11.78 10.26,11.78 v1(9.52,12.53)
IO37/MISO: length 28
  Top Layer w0.154: 30.97,12.8 v1(30.2,12.8) ; 4.55,10.83 4.55,11.3 6.62,13.38 v1(10.68,13.38)
  Bottom Layer w0.154: v1(30.2,12.8) 30.08,12.92 11.13,12.92 v1(10.68,13.38)
IO39/CS: length 23.3
  Top Layer w0.154: 30.97,14.5 30.68,14.5 29.7,13.53 v1(29.38,13.53) ; v1(11.52,13.45) 11.52,13.45 10.05,11.97 10.05,10.83
  Bottom Layer w0.154: v1(29.38,13.53) 29.05,13.2 11.78,13.2 v1(11.52,13.45)
MIC_DATA1: length 12.4
  Top Layer w0.154: U3.6 8.39,23.59 v1(8.6,23.8) ; 17.02,16.2 16.38,16.2 v1(16.18,16.4)
  Bottom Layer w0.154: v1(16.18,16.4) 16,16.4 v1(8.6,23.8)
MIC_DATA2: length 22.9
  Top Layer w0.154: 17.03,13.65 17.3,13.65 17.75,13.2 26.43,13.2 28.55,15.33 v1(28.55,15.53) ; v1(34.73,21.31) 34.91,21.48 35.47,21.48
  Bottom Layer w0.154: v1(34.73,21.31) 34.73,20.08 30.18,15.53 v1(28.55,15.53)
MOTR: length 13.7
  Top Layer w0.154: R15.2 v1(31.97,7.72) ; U1.20 v1(21.45,10.85)
  Bottom Layer w0.154: v1(21.45,10.85) 22.2,10.1 29.6,10.1 v1(31.97,7.72)
POWER_+3V3: length 28.8
  Top Layer w0.2: R1.1 15.64,19.75 v1(15.03,19.75) ; U3.5 8.46,23.19 v1(8.63,23.02) 9.03,23.42 10.36,23.42 v1(10.55,23.23) ; v1(33.23,21.37) 33.56,21.7 C23.1 34.13,21.88 U19.5 ; U19.2 34.99,23.08 34.78,23.3 v1(33.53,23.3) 33.16,23.3 R3.2 ; 7.85,10.83 7.85,10.35 8.65,9.55 13.12,9.55 14.41,10.84 C14.1 15.47,10.85 15.47,12.1 ; U3.2 8.46,21.99 v1(8.62,21.83)
  Top Layer w0.254: 15.45,12.06 15.19,12.31 v1(14.4,12.31) ; 17.03,21.3 15.67,21.3 C2.2 15.63,21.25 C1.2 v1(13.65,21.25)
  Top Layer w0.4: U4.3 44.6,10.45 C11.2 C10.2 v1(42.28,11.27)
  Bottom Layer w0.2: v1(8.63,23.02) 8.62,23.01 v1(8.62,21.83)
POWER_VDC: length 11.2
  Top Layer w0.3: v1(42.82,7.8) 45.4,7.8 45.56,7.96
  Top Layer w0.4: P2.1 45.91,13.49 45.56,13.13 45.56,7.96
  Bottom Layer w0.3: JP1.1 42.8,7.83 v1(42.82,7.8)
STAT: length 28.6
  Top Layer w0.154: v1(40.38,2.58) 40.38,2.88 40.03,3.22 39.7,3.22 ; v1(18.05,10.9) 17.82,10.9 17.65,11.08 U1.15
  Bottom Layer w0.154: v1(40.38,2.58) 39.68,1.88 34.98,1.88 33.08,3.78 26.8,3.78 21.3,9.28 19.68,9.28 v1(18.05,10.9)
$1N1776: length 1.3
  Top Layer w0.2: LED1.2 37.23,15.35 R5.1
$1N1782: length 5.4
  Top Layer w0.2: 30.97,15.35 31.01,15.32 R5.2
$1N2565: length 1.3
  Top Layer w0.3: 37.38,1.94 37.38,3.21 U2.5
$1N4192: length 1.6
  Top Layer w0.2: C16.2 9.37,22.39 U3.3
$1N4769: length 1.3
  Top Layer w0.2: C17.2 8.62,21.03 8.06,21.59 U3.1
$1N4937: length 1.1
  Top Layer w0.2: C18.2 4.54,22.39 4.98,22.39
$1N4974: length 1
  Top Layer w0.154: C19.2 4.98,24.96 4.98,23.99
$1N5042: length 6.8
  Top Layer w0.2: 2.46,21.9 2.38,21.98 2.38,24.08 3.28,24.97 ; 3.28,24.97 C19.1 ; 3.28,24.97 2.85,25.4 2.85,26.9
$1N5142: length 2.1
  Top Layer w0.2: 2.94,21.9 2.96,21.88 4.11,21.88 4.21,21.99 4.98,21.99
$1N5258: length 2.3
  Top Layer w0.2: R11.1 2.93,20.94 3.06,20.94 3.3,21.17 3.84,21.17 R10.2 4.47,21.4 4.66,21.59 4.98,21.59
$1N5975: length 0.9
  Top Layer w0.2: C21.2 35.46,22.67 35.47,22.68
$1N5978: length 0.9
  Top Layer w0.2: 35.47,23.48 35.47,23.49 35.47,24.42
$1N5981: length 1.1
  Top Layer w0.2: 39.39,22.55 39.26,22.68 38.32,22.68
$1N5983: length 2.6
  Top Layer w0.2: U19.8 38.59,21.08 38.79,20.88 40.48,20.88 C25.2
$1N5985: length 8.7
  Top Layer w0.2: C25.1 40.7,23.54 R12.1 42.8,23.55 MIC2.1
$1N5990: length 2.1
  Top Layer w0.2: R12.2 R13.1 38.81,23.08 38.32,23.08
$1N5994: length 2.3
  Top Layer w0.2: 38.32,23.48 38.44,23.48 38.98,24.03 39.27,24.03 39.74,24.5 R14.1
$1N6124: length 1.5
  Top Layer w0.2: R2.1 31.05,22.08 30.97,22.15
$1N6163: length 1.5
  Top Layer w0.2: 30.97,19.6 32.44,19.6 R4.1
$1N6361: length 1.4
  Top Layer w0.2: R15.1 35.22,7.72
$1N6452: length 13
  Top Layer w0.3: P1.1 45.91,16.41 42.12,12.62 38.82,12.62 36.18,9.97 Q1.3
$1N16448: length 1.4
  Top Layer w0.254: USB1.4 22.72,8.03 R16.2
$1N16453: length 1.4
  Top Layer w0.254: R7.2 26.32,8.41 25.72,7.82 USB1.10

## Copper pours and planes (outline as drawn; the poured copper is in the pictures)
GND on Top Layer: -0.47,24.55 48.6,24.55 48.6,-1.2 -0.47,-1.2
GND on Bottom Layer: -0.6,24.55 49.2,24.55 49.2,-1.4 -0.6,-1.4
GND on Inner1: 0.26,29.74 47.74,29.74 47.74,0.26 0.26,0.26
CHRG5V on Top Layer: 37.84,5.56 38.03,5.37 38.02,4.8 37.8,4.62 31.8,4.62 31.2,4.03 29.59,4.03 29.3,4.32 29.3,5.36 29.55,5.56
POWER_+3V3 on Inner2: 0.26,29.74 47.74,29.74 47.74,0.26 0.26,0.26
POWER_VDC on Top Layer: 46.2,0.78 46.2,5.08 45.93,5.34 45.93,8.41 45.78,8.58 45.3,8.58 45.18,8.45 45.18,7.29 45.25,7.22 45.25,6.37 44.97,6.1 44.97,5.22 44.68,4.92 43.03,4.92 42.3,5.65 39.22,5.65 38.97,5.4 38.97,4.83 39.2,4.6 42.12,4.6 42.68,4.05 43.62,4.05 44.12,3.55 44.12,0.78 44.28,0.62 46.05,0.62

Small or netless copper shapes (teardrops, artwork), in the pictures only: 22 on Inner1
